# EAGLE design midi_nubbin (EAGLE 6.6.0)
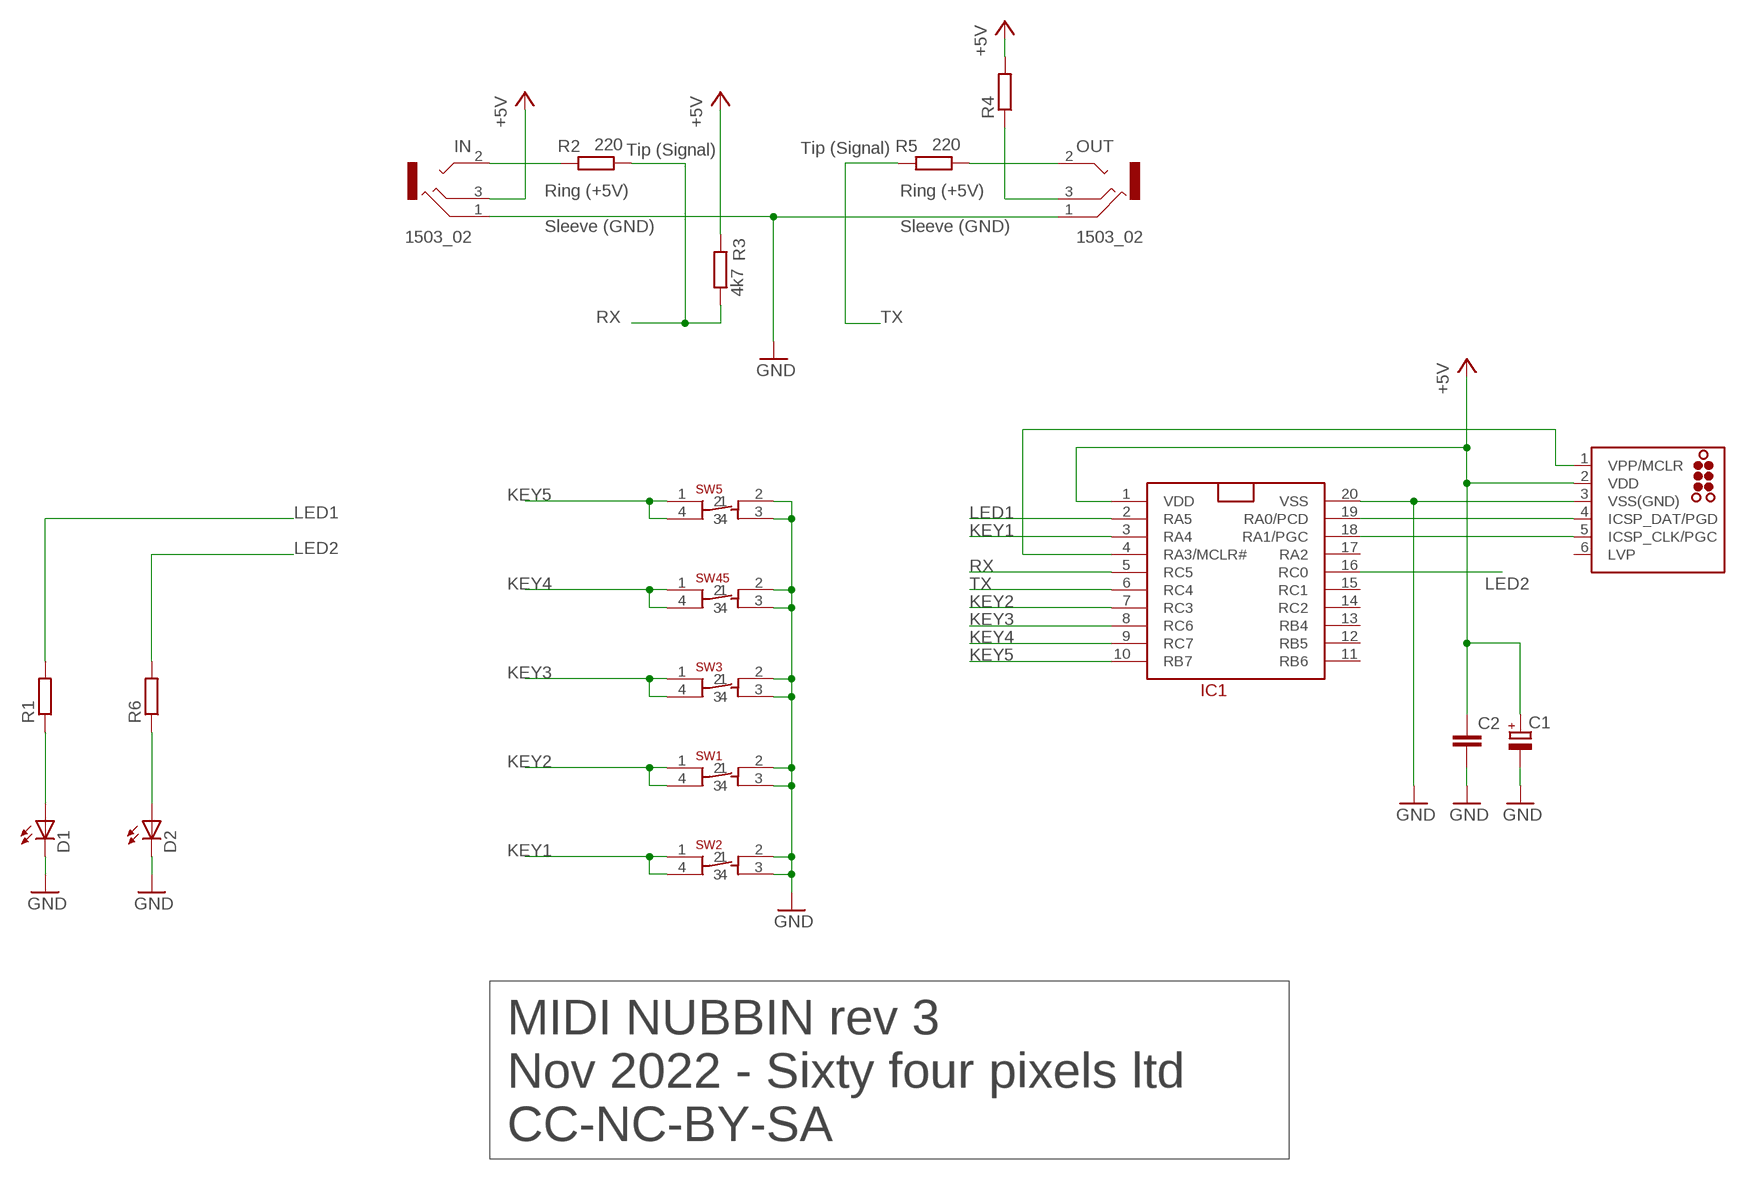
[diagram p0: schematic, sheet 1]

## Parts
C1  CPOL-EUSMCB  [SMC_B]
C2  C-EUC0805  [C0805]
D1  LEDCHIPLED_0805  [CHIPLED_0805]
D2  LEDCHIPLED_0805  [CHIPLED_0805]
IC1  PIC16F15345SSOP20  [SSOP20]
ICSP  TC2030-MCP-NL  [TC2030-MCP-NL]
IN  1503_02  [1503_02]
OUT  1503_02  [1503_02]
R1  R-EU_R0805  [R0805]
R2  220  R-EU_R0805  [R0805]
R3  4k7  R-EU_R0805  [R0805]
R4  R-EU_R0805  [R0805]
R5  220  R-EU_R0805  [R0805]
R6  R-EU_R0805  [R0805]
SW1  6MMTACTSMT  [6MMTACTSMT]
SW2  6MMTACTSMT  [6MMTACTSMT]
SW3  6MMTACTSMT  [6MMTACTSMT]
SW5  6MMTACTSMT  [6MMTACTSMT]
SW45  6MMTACTSMT  [6MMTACTSMT]

## Nets
+5V: C1.+ C2.1 IC1.1(VDD) ICSP.2(VDD) IN.3 R3.2 R4.2
GND: C1.- C2.2 D1.C D2.C IC1.20(VSS) ICSP.3(VSS(GND)) IN.1 OUT.1 SW1.2 SW1.3 SW2.2 SW2.3 SW3.2 SW3.3 SW5.2 SW5.3 SW45.2 SW45.3
KEY1: IC1.3(RA4) SW2.1 SW2.4
KEY2: IC1.7(RC3) SW1.1 SW1.4
KEY3: IC1.8(RC6) SW3.1 SW3.4
KEY4: IC1.9(RC7) SW45.1 SW45.4
KEY5: IC1.10(RB7) SW5.1 SW5.4
LED1: IC1.2(RA5) R1.2
LED2: IC1.16(RC0) R6.2
N$1: D1.A R1.1
N$2: D2.A R6.1
N$3: OUT.3 R4.1
N$4: OUT.2 R5.1
N$5: IN.2 R2.2
PGC: IC1.18(RA1/PGC) ICSP.5(ICSP_CLK/PGC)
PGD: IC1.19(RA0/PCD) ICSP.4(ICSP_DAT/PGD)
RX: IC1.5(RC5) R2.1 R3.1
TX: IC1.6(RC4) R5.2
VPP: IC1.4(RA3/MCLR#) ICSP.1(VPP/MCLR)
Unconnected: IC1.11(RB6) IC1.12(RB5) IC1.13(RB4) IC1.14(RC2) IC1.15(RC1) IC1.17(RA2) ICSP.6(LVP) IN.2@2 OUT.2@2

## Notes on the sheet
- Tip (Signal) | Tip (Signal)
- Ring (+5V) | Ring (+5V)
- Sleeve (GND) | Sleeve (GND)
- MIDI NUBBIN rev 3
- Nov 2022 - Sixty four pixels ltd
- CC-NC-BY-SA

## Library data of the parts
C1 = resistor:CPOL-EU: POLARIZED CAPACITOR, European symbol
C2 = rcl:C-EU: CAPACITOR, European symbol
D1 D2 = adafruit:LED: LED OSRAM: - CHIPLED LG R971, LG N971, LY N971, LG Q971, LY Q971, LO R971, LY R971 LH N974, LH R974 LS Q976, LO Q976, LY Q976 LO Q996 - Hyper CHIPLED LW Q18S LB Q993, LB Q99A, LB R99A - SideLED LS A670, LO A670, LY A670, LG A670, LP A670 LB A673, LV A673, LT A673, LW A673 LH A674 LY A675 LS A676, LA A676, LO A676, LY A676, LW A676 LS A679, LY A679, LG A679 - Hyper Micro SIDELED® LS Y876, LA Y876, LO Y876, LY Y876 LT Y87S - SmartLED LW L88C, LW L88S LB L89C, LB L89S, LG L890 LS L89K, LO L89K, LY L89K LS L896, LA L896, LO L896, LY L896 - TOPLED LS T670, LO T670, LY T670, LG T670, LP T670 LSG T670, LSP T670, LSY T670, LOP T670, LYG T670 LG T671, LOG T671, LSG T671 LB T673, LV T673, LT T673, LW T673 LH T674 LS T676, LA T676, LO T676, LY T676, LB T676, LH T676, LSB T676, LW T676 LB T67C, LV T67C, LT T67C, LS T67K, LO T67K, LY T67K, LW E67C LS E67B, LA E67B, LO E67B, LY E67B, LB E67C, LV E67C, LT E67C LW T67C LS T679, LY T679, LG T679 LS T770, LO T770, LY T770, LG T770, LP T770 LB T773, LV T773, LT T773, LW T773 LH T774 LS E675, LA E675, LY E675, LS T675 LS T776, LA T776, LO T776, LY T776, LB T776 LHGB T686 LT T68C, LB T68C - Hyper Mini TOPLED® LB M676 - Mini TOPLED Santana® LG M470 LS M47K, LO M47K, LY M47K Source: http://www.osram.convergy.de/
IC1 = jason_eagle6:PIC16F15345
ICSP = tag-connect:TC2030: TAG-CONNECT ICSP Connector Manufacturer: Tag-Connect <http://www.tag-connect.com> Cable for easy In-Circuit Serial Programming. Designed for Microchip ICD2, suitable for many others. Two variants - one "with legs" (for hands-free fit on PCB) and another "without legs" for quick programming. PAD Description 1 MCLR/Vpp 2 Vdd 3 GND 4 PGD (ISPDAT) 5 PGC (ISPCLK) 6 nc (used for LVP) ©2009 ROFA.cz - modified and updated by Robert Darlington ‹rdarlington@gmail.com›
IN OUT = con-lumberg:1503_02: Jack connectors according to JISC 6560, 3.5 mm Klinkeneinbaukupplung nach JISC 6560, 3,5 mm, 3-polig/stereo, abgewinkelte Ausführung, Surface-Mount-Technik (SMT) Source: http://www.lumberg.com/Produkte/PDFs/1503_02.pdf; OC_FARNELL: 1216979; OC_NEWARK: unknown
R1-R6 = rcl:R-EU_: RESISTOR, European symbol
SW1-SW3 SW5 SW45 = jason_eagle6:6MMTACTSMT

## Board
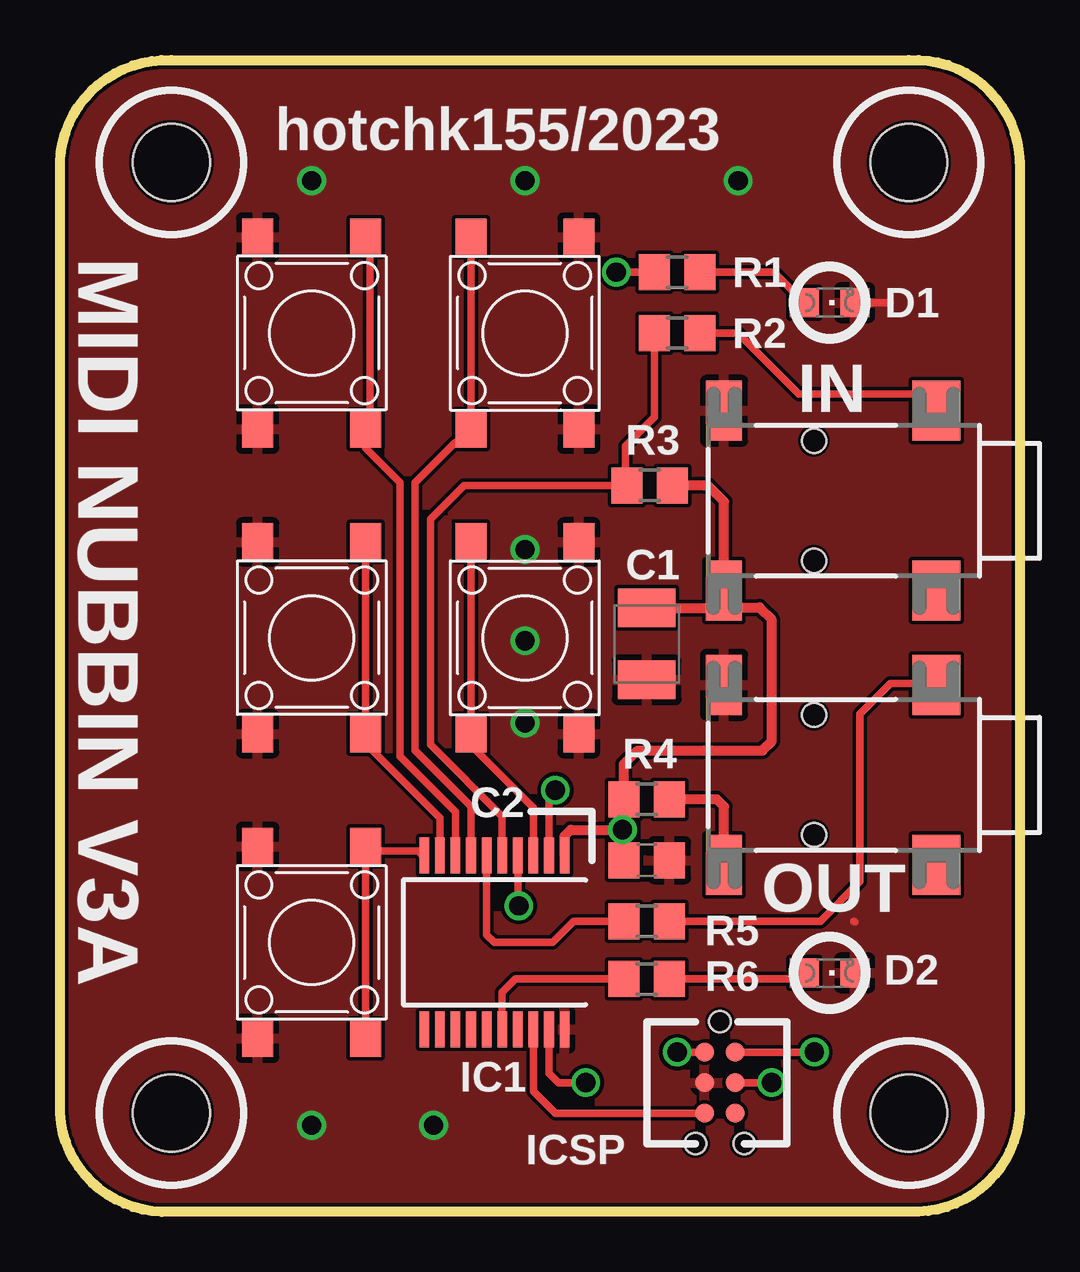
[diagram p1: board, top side]
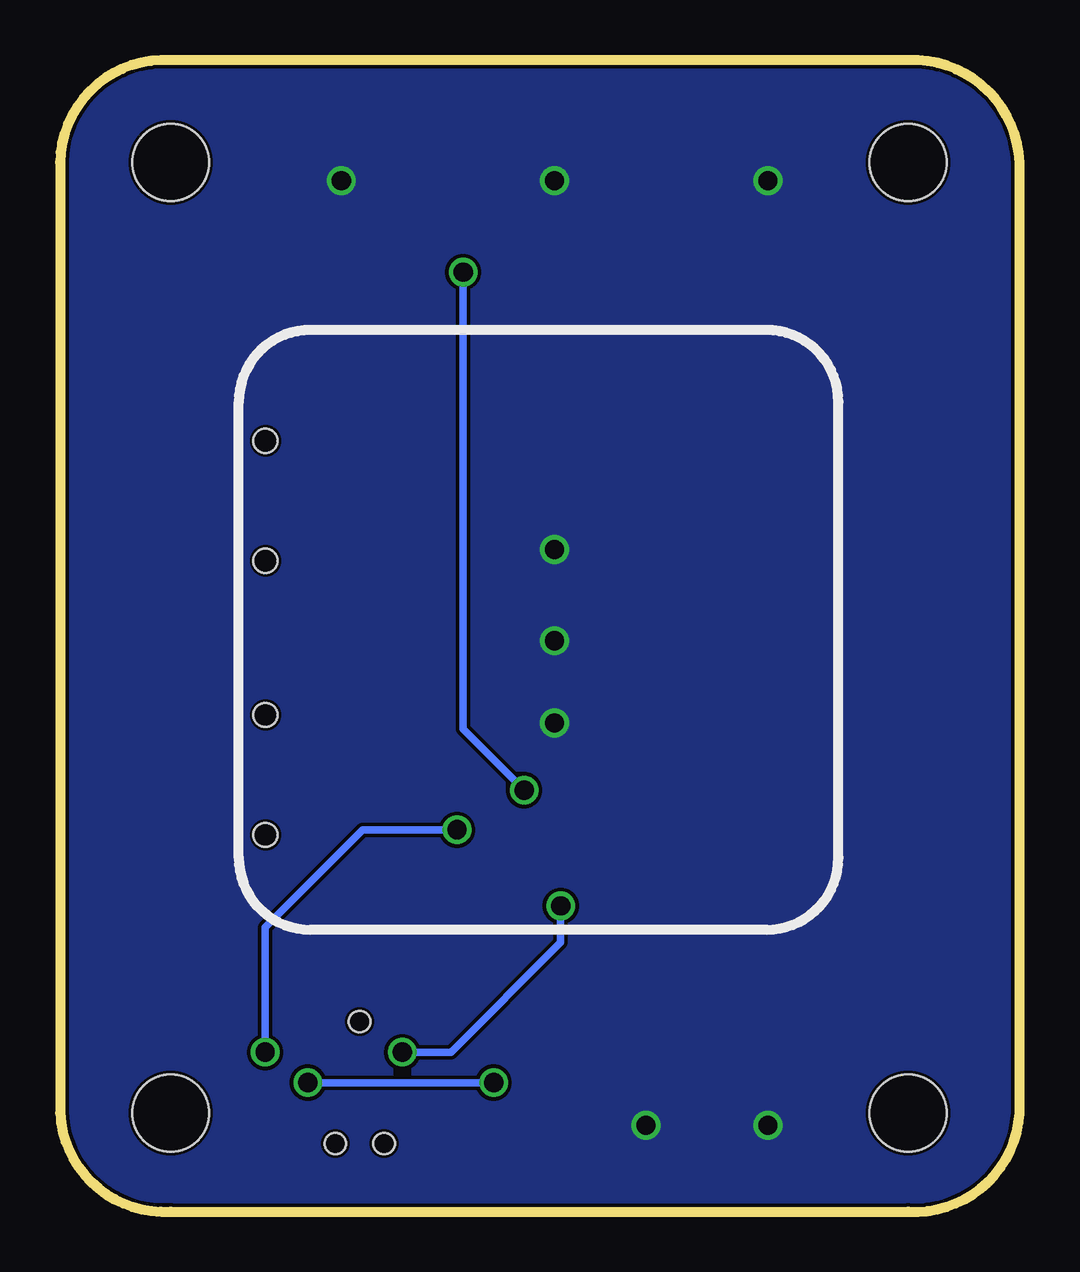
[diagram p2: board, bottom side, seen from below]

Size 40 x 48.01 mm. Coordinates in mm from the lower left corner, seen from the top.
Outline: 4.65,48.01 35.38,48.01 arc-92 40,43.74 40,4.11 arc-90 35.38,0.01 4.65,0.01 arc-90 0,4.11 0,43.74 arc-90 4.65,48.01
Copper layers (1*16): Top 0.035mm / dielectric 1.5mm / Bottom 0.035mm
Design rules "hackvana": minimum track width 6mil, minimum drill 0.3mm, track to track 6mil, track to pad 9mil, pad to pad 6mil, via to via 6mil, smd to smd 0mil, copper to edge 6mil, drill to drill 6mil, minimum pad ring 10mil, minimum via ring 6mil, stop-mask expansion 2mil, vias tented up to drill 100mil, thermal gap 10mil
Holes 3.2 mm at 4.65,43.74 4.65,4.11 35.38,43.74 35.38,4.11

### Footprints (pad centres in the part's own frame; a part is rotated, then mirrored left to right if it is on the bottom)
SMC_B = smd 1.6 x 2.4: + -1.5,0; - 1.5,0
C0805 = smd 1.3 x 1.5: 1 -0.95,0; 2 0.95,0
CHIPLED_0805 = smd 1.2 x 1.2: A 0,-1.05; C 0,1.05
SSOP20 = smd 0.4 x 1.5: 1 -2.925,-3.625; 2 -2.275,-3.625; 3 -1.625,-3.625; 4 -0.975,-3.625; 5 -0.325,-3.625; 6 0.325,-3.625; 7 0.975,-3.625; 8 1.625,-3.625; 9 2.275,-3.625; 10 2.925,-3.625; 11 2.925,3.625; 12 2.275,3.625; 13 1.625,3.625; 14 0.975,3.625; 15 0.325,3.625; 16 -0.325,3.625; 17 -0.975,3.625; 18 -1.625,3.625; 19 -2.275,3.625; 20 -2.925,3.625
TC2030-MCP-NL = smd 0.787 x 0.787: 1 1.27,-0.635; 2 1.27,0.635; 3 2.54,-0.635; 4 2.54,0.635; 5 3.81,-0.635; 6 3.81,0.635 | hole 0.889: 0,0; 5.08,-1.016; 5.08,1.016
1503_02 = smd 2.5 x 1.5: 1 -3.75,-10.75; 3 3.75,-10.75 | smd 2.5 x 2: 2 -3.75,-1.9; 2@2 3.75,-1.9 | hole 1: -2.5,-7; 2.5,-7
R0805 = smd 1.3 x 1.5: 1 -0.95,0; 2 0.95,0
6MMTACTSMT = smd 1.55 x 1.3: 1 -4,2.25; 2 -4,-2.25; 3 4,-2.25; 4 4,2.25

### Placement (x,y rotation side)
C1  24.46,23.67 270 top
C2  24.46,14.66 0 top
D1  32.08,37.9 270 top
D2  32.08,9.96 270 top
IC1  18.11,11.23 180 top
ICSP  27.51,7.92 270 top
IN  38.43,29.64 270 top
OUT  38.43,18.21 270 top
R1  25.73,39.17 180 top
R2  25.73,36.63 0 top
R3  24.59,30.28 0 top
R4  24.46,17.2 180 top
R5  24.46,12.12 180 top
R6  24.46,9.7 180 top
SW1  19.38,36.63 90 top
SW2  19.38,23.93 90 top
SW3  10.49,36.63 270 top
SW5  10.49,11.23 270 top
SW45  10.49,23.93 270 top

### Tracks (layer width: path | path; a pad name or v marks a point on that pad's centre or on a via)
+5V  (via drill 0.8)
  Top 0.305: 21.04,14.66 IC1.1 | ICSP.2 v31.45,6.65
  Top 0.406: R3.2 27,30.28 27.68,29.6 IN.3 27.25,25.46 | C1.+ 26.96,25.17 27.25,25.46 | 27.25,25.46 27.5,25.46 27.76,25.2 29.16,25.2 29.67,24.69 29.67,19.61 29.29,19.23 24.08,19.23 23.51,18.66 R4.2 23.44,17.13 v23.44,15.93 | IC1.1 21.04,15.68 21.29,15.93 v23.44,15.93 | v23.44,15.93 23.44,14.72 C2.1
  Bottom 0.305: v31.45,6.65 31.45,11.86 27.38,15.93 v23.44,15.93
GND  (via drill 0.8)
  Top 0.305: D1.C 34.62,37.9 | 33.13,12.08 33.1,12.12
  other vias: 10.49,42.98 19.38,42.98 28.27,42.98 10.49,3.61 15.57,3.61 19.38,27.61 19.38,20.37 19.38,23.8
  pour Top: 0.1,47.61 39.6,47.61 39.6,0.41 0.1,0.41
  pour Bottom: 0.3,47.51 39.7,47.51 39.7,0.41 0.3,0.41
KEY1
  Top 0.305: SW2.4 SW2.1 17.13,19.45 19.73,16.84 IC1.3
KEY2
  Top 0.305: IC1.7 17.14,16.9 14.81,19.23 14.81,30.4 16.46,32.05 16.56,32.05 SW1.1 | SW1.1 16.94,32.82 16.84,32.82 16.84,32.69 | SW1.4 SW1.1
KEY3
  Top 0.305: IC1.8 16.48,16.66 14.17,18.97 14.17,30.4 12.74,31.84 SW3.4 12.93,32.82 | 13.03,32.82 12.93,32.82 | SW3.1 12.93,40.44 12.93,32.82
KEY4
  Top 0.305: IC1.9 15.84,16.42 12.74,19.52 SW45.4 | SW45.4 12.84,19.93 13.03,20.12 | SW45.1 SW45.4
KEY5
  Top 0.305: IC1.10 15.19,14.79 14.94,15.04 12.93,15.04 SW5.1 SW5.4
LED1  (via drill 0.8)
  Top 0.305: IC1.2 20.39,17.31 v20.65,17.58 | v23.19,39.17 R1.2
  Bottom 0.305: v20.65,17.58 23.19,20.12 v23.19,39.17
LED2
  Top 0.305: IC1.16 18.43,9.14 19,9.7 R6.2
N$1
  Top 0.305: R1.1 29.76,39.17 D1.A
N$2
  Top 0.305: R6.1 30.78,9.7 D2.A
N$3
  Top 0.305: 28.27,15.04 28.25,15.04 OUT.3
  Top 0.406: OUT.3 27.68,16.9 27.38,17.2 R4.1
N$4
  Top 0.305: R5.1 31.7,12.12 33.35,13.77 33.35,20.75 34.62,22.02 36.52,22.02 37.16,22.66 37.16,22.59 OUT.2
N$5
  Top 0.305: R2.2 28.27,36.63 30.81,34.09 37.16,34.09 37.16,34.02 IN.2
PGC
  Top 0.305: ICSP.5 20.65,4.11 19.73,5.03 IC1.18
PGD  (via drill 0.8)
  Top 0.305: IC1.19 20.39,5.78 20.78,5.38 v21.92,5.38 | v29.67,5.38 ICSP.4
  Bottom 0.305: v21.92,5.38 v29.67,5.38
RX
  Top 0.305: IC1.5 18.43,16.49 15.44,19.48 15.44,28.88 16.84,30.28 R3.1 23.57,30.34 23.57,31.93 24.78,33.14 R2.1
TX
  Top 0.305: IC1.6 17.79,11.55 18.11,11.23 20.52,11.23 21.41,12.12 R5.2
VPP  (via drill 0.8)
  Top 0.305: ICSP.1 v25.73,6.65 | IC1.4 19.09,12.79 v19.13,12.75
  Bottom 0.305: v25.73,6.65 23.7,6.65 19.13,11.23 v19.13,12.75

### Text on the board
tPlace: hotchk155/2023 | MIDI NUBBIN V3A